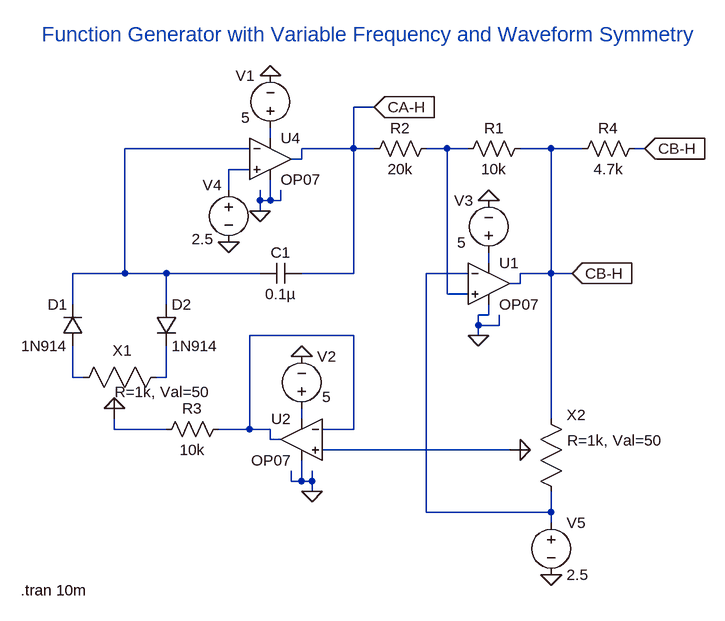
[diagram p0: schematic function_gen_variable_freq_and_waveform_sym_ltspice.asc]
function_gen_variable_freq_and_waveform_sym_ltspice.asc, the LTspice schematic file:
Version 4
SHEET 1 1192 936
WIRE 496 176 464 176
WIRE 336 224 336 208
WIRE 304 240 112 240
WIRE 464 240 464 176
WIRE 464 240 384 240
WIRE 496 240 464 240
WIRE 608 240 576 240
WIRE 640 240 608 240
WIRE 768 240 720 240
WIRE 816 240 768 240
WIRE 912 240 896 240
WIRE 384 256 384 240
WIRE 384 256 368 256
WIRE 304 272 272 272
WIRE 272 304 272 272
WIRE 320 320 320 304
WIRE 336 320 336 288
WIRE 336 320 320 320
WIRE 352 320 352 304
WIRE 352 320 336 320
WIRE 320 336 320 320
WIRE 672 416 672 400
WIRE 112 432 112 240
WIRE 112 432 32 432
WIRE 176 432 112 432
WIRE 320 432 176 432
WIRE 464 432 464 240
WIRE 464 432 384 432
WIRE 640 432 576 432
WIRE 768 432 768 240
WIRE 768 432 720 432
WIRE 800 432 768 432
WIRE 720 448 720 432
WIRE 720 448 704 448
WIRE 608 464 608 240
WIRE 640 464 608 464
WIRE 32 480 32 432
WIRE 176 480 176 432
WIRE 672 496 672 480
WIRE 672 496 656 496
WIRE 656 512 656 496
WIRE 688 512 688 496
WIRE 688 512 656 512
WIRE 464 528 304 528
WIRE 656 528 656 512
WIRE 32 592 32 544
WIRE 48 592 32 592
WIRE 176 592 176 544
WIRE 176 592 160 592
WIRE 384 656 384 640
WIRE 768 656 768 432
WIRE 96 672 96 656
WIRE 176 672 96 672
WIRE 304 672 304 528
WIRE 304 672 256 672
WIRE 336 672 304 672
WIRE 464 672 464 528
WIRE 464 672 416 672
WIRE 336 688 336 672
WIRE 352 688 336 688
WIRE 704 704 416 704
WIRE 368 752 368 736
WIRE 384 752 384 720
WIRE 384 752 368 752
WIRE 400 752 400 736
WIRE 400 752 384 752
WIRE 400 768 400 752
WIRE 576 800 576 432
WIRE 768 800 768 768
WIRE 768 800 576 800
WIRE 768 816 768 800
FLAG 320 336 0
FLAG 400 768 0
FLAG 656 528 0
FLAG 336 128 0
FLAG 384 560 0
FLAG 672 320 0
FLAG 272 384 0
FLAG 768 896 0
FLAG 496 176 CA-H
IOPIN 496 176 In
FLAG 800 432 CB-H
IOPIN 800 432 In
FLAG 912 240 CB-H
IOPIN 912 240 In
SYMBOL voltage 336 224 R180
WINDOW 0 24 96 Left 2
WINDOW 3 31 32 Left 2
SYMATTR InstName V1
SYMATTR Value 5
SYMBOL voltage 384 656 M180
WINDOW 0 24 96 Left 2
WINDOW 3 32 34 Left 2
SYMATTR InstName V2
SYMATTR Value 5
SYMBOL voltage 672 416 R180
WINDOW 0 24 96 Left 2
WINDOW 3 35 31 Left 2
SYMATTR InstName V3
SYMATTR Value 5
SYMBOL voltage 272 288 R0
WINDOW 0 -40 8 Left 2
WINDOW 3 -57 91 Left 2
SYMATTR InstName V4
SYMATTR Value 2.5
SYMBOL potentiometer 64 608 R270
WINDOW 0 57 59 VLeft 2
WINDOW 39 -7 179 VLeft 2
SYMATTR InstName X1
SYMATTR SpiceLine R=1k, Val=50
SYMBOL diode 48 544 R180
WINDOW 0 24 64 Left 2
WINDOW 3 24 0 Left 2
SYMATTR InstName D1
SYMATTR Value 1N914
SYMBOL diode 160 480 R0
SYMATTR InstName D2
SYMATTR Value 1N914
SYMBOL res 272 656 R90
WINDOW 0 0 56 VBottom 2
WINDOW 3 32 56 VTop 2
SYMATTR InstName R3
SYMATTR Value 10k
SYMBOL res 592 224 R90
WINDOW 0 0 56 VBottom 2
WINDOW 3 32 56 VTop 2
SYMATTR InstName R2
SYMATTR Value 20k
SYMBOL res 736 224 R90
WINDOW 0 0 56 VBottom 2
WINDOW 3 32 56 VTop 2
SYMATTR InstName R1
SYMATTR Value 10k
SYMBOL res 912 224 R90
WINDOW 0 0 56 VBottom 2
WINDOW 3 32 56 VTop 2
SYMATTR InstName R4
SYMATTR Value 4.7k
SYMBOL potentiometer 752 672 R0
WINDOW 0 40 -22 Left 2
WINDOW 39 41 17 Left 2
SYMATTR InstName X2
SYMATTR SpiceLine R=1k, Val=50
SYMBOL voltage 768 800 R0
SYMATTR InstName V5
SYMATTR Value 2.5
SYMBOL cap 384 416 R90
WINDOW 0 0 32 VBottom 2
WINDOW 3 32 32 VTop 2
SYMATTR InstName C1
SYMATTR Value 0.1µ
SYMBOL Opamps\\OP07 336 192 R0
SYMATTR InstName U4
SYMBOL Opamps\\OP07 672 384 R0
SYMATTR InstName U1
SYMBOL Opamps\\OP07 384 624 M0
SYMATTR InstName U2
TEXT -16 64 Left 3 ;Function Generator with Variable Frequency and Waveform Symmetry
TEXT -48 920 Left 2 !.tran 10m

The netlist it stands for:
* function_gen_variable_freq_and_waveform_sym_ltspice.asc
V1 N001 0 5
V2 N010 0 5
V3 N005 0 5
V4 N004 0 2.5
XX1 N008 N011 N009 potentiometer R=1k, Val=50  ; pins 1 2 3
D1 N008 N002 1N914
D2 N002 N009 1N914
R3 N007 N011 10k
R2 N003 CA-H 20k
R1 CB-H N003 10k
R4 CB-H CB-H 4.7k
XX2 CB-H N012 N006 potentiometer R=1k, Val=50  ; pins 1 2 3
V5 N006 0 2.5
C1 CA-H N002 0.1µ
XU4 N004 N002 N001 0 CA-H LT1001  ; OP07, pins In+ In- V+ V- OUT
XU1 N003 N006 N005 0 CB-H LT1001  ; OP07, pins In+ In- V+ V- OUT
XU2 N012 N007 N010 0 N007 LT1001  ; OP07, pins In+ In- V+ V- OUT
.model D D
.lib standard.dio
* Function Generator with Variable Frequency and Waveform Symmetry
.tran 10m
.lib LTC.lib
.backanno
.end